# EAGLE design Arduino-M0-V1 (EAGLE 6.4)

## Sheet 1 of 2
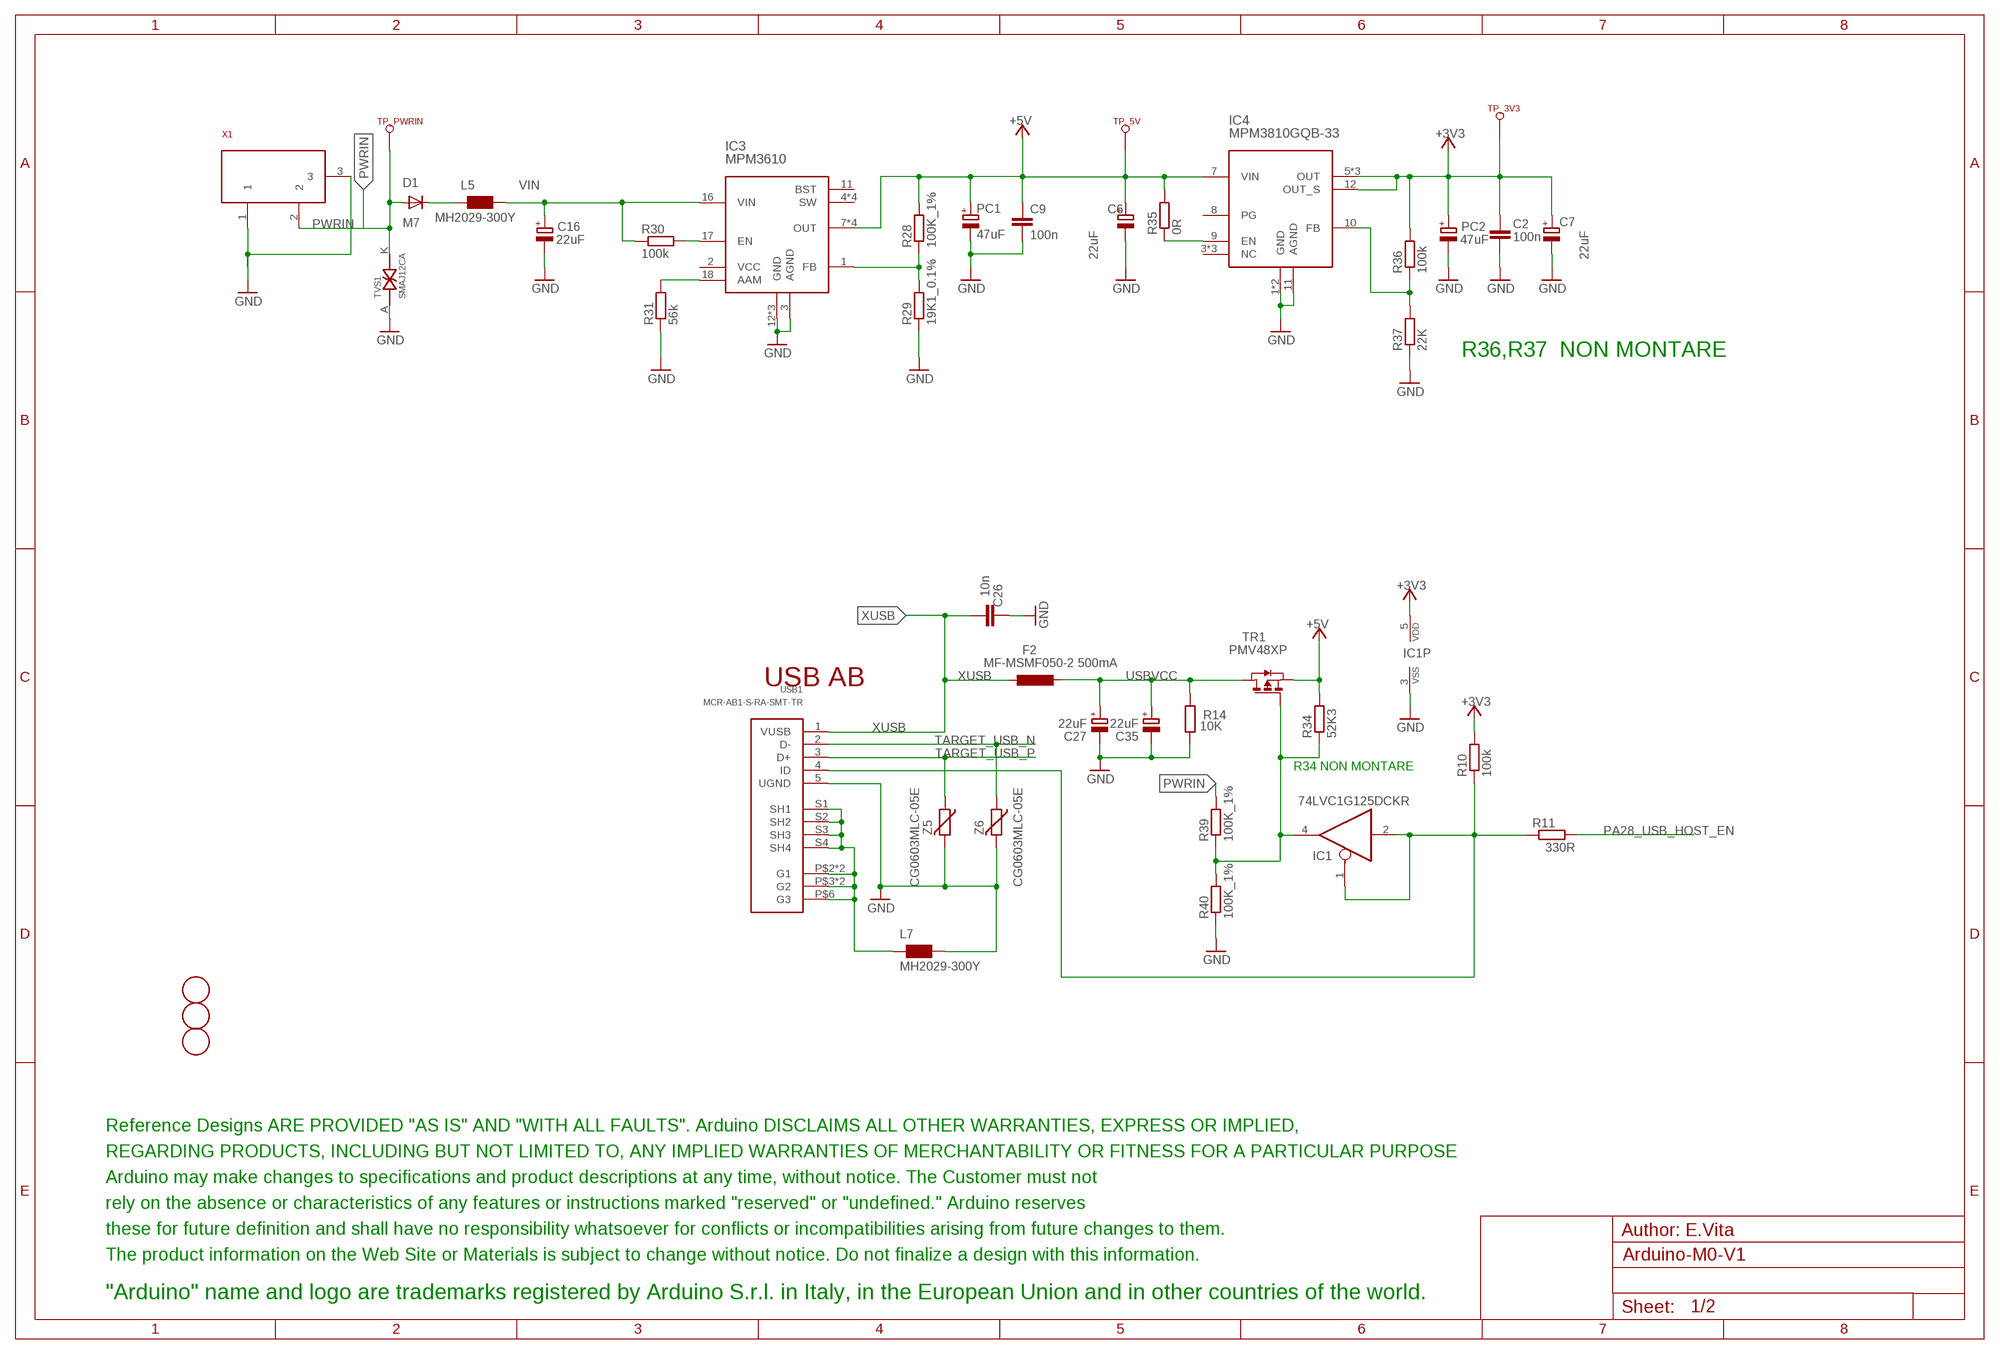
[diagram p0: schematic, sheet 1]

### Parts
C2  100n  0015_100NF_0603  [C0603-ROUND]
C6  22uF  0167_  [SMC_B]
C7  22uF  0167_  [SMC_B]
C9  100n  0015_100NF_0603  [C0603-ROUND]
C16  22uF  0167_  [SMC_B]
C26  10n  0142_10NF_0603  [C0603-ROUND]
C27  22uF  0167_  [SMC_B]
C35  22uF  0167_  [SMC_B]
D1  M7  0020_M7  [SMB]
F2  MF-MSMF050-2 500mA  0002_MF-MSMF050-2  [L1812]
FD1  FIDUCIALMOUNT  [FIDUCIA-MOUNT]
FD2  FIDUCIALMOUNT  [FIDUCIA-MOUNT]
FD3  FIDUCIALMOUNT  [FIDUCIA-MOUNT]
IC1  74LVC1G125DCKR  0040_SN74LVC1G125DCKR  [SC70-5]
IC3  MPM3610  2093_MPM3610GQV-P  [QFN-20]
IC4  MPM3810GQB-33  2068_MPM3810GQB-33  [QFN-12]
L5  MH2029-300Y  0001_BLM21PG300SN1D_/_MH2029-300Y  [0805]
L7  MH2029-300Y  0001_BLM21PG300SN1D_/_MH2029-300Y  [0805]
PC1  47uF  0113_47UF  [PANASONIC_D]
PC2  47uF  0113_47UF  [PANASONIC_D]
R10  100k  0026_100K_0603  [R0603-ROUND]
R11  330R  0049_330R_0603  [R0603-ROUND]
R14  10K  0028_CR0603JW103L  [R0603-ROUND]
R28  100K_1%  2022_CR0603FW104L  [R0603-ROUND]
R29  19K1_0.1%  2339_  [R0603-ROUND]
R30  100k  0026_100K_0603  [R0603-ROUND]
R31  56k  0411_56K_0603  [R0603-ROUND]
R34  52K3  0180_52K3_0603  [R0603-ROUND]
R35  0R  0233_0R_0603  [R0603-ROUND]
R36  100k  0026_100K_0603  [R0603-ROUND]
R37  22K  0194_  [R0603-ROUND]
R39  100K_1%  2022_CR0603FW104L  [R0603-ROUND]
R40  100K_1%  2022_CR0603FW104L  [R0603-ROUND]
TP_3V3  TP_SP  [TP-SP]
TP_5V  TP_SP  [TP-SP]
TP_PWRIN  TP_SP  [TP-SP]
TR1  PMV48XP  0297_PMV48XP  [SOT-23]
TVS1  SMAJ12CA  2194_SMAJ12CA  [SMA-TVS]
U$1  DISCLAIMER-SMALL  [DISCLAIMER]
USB1  MCR-AB1-S-RA-SMT-TR  0631_MCR-AB1-S-RA-SMT-TRHOLES  [MCR-AB1-S-RA-SMT-SINGLHOLES]
X1  0018_19746-POWER-SUPPLY  [POWERSUPPLY_DC-21MM]
Z5  CG0603MLC-05E  0010_BRNCG0603MLC-05E  [CT/CN0603]
Z6  CG0603MLC-05E  0010_BRNCG0603MLC-05E  [CT/CN0603]

### Nets
+3V3: C2.2 C7.+ IC1.5(VDD) IC4.5(OUT) IC4.6(OUT) IC4.12(OUT_S) IC4.14(OUT) PC2.+ R10.2 R36.2 TP_3V3.X(TESTP) ; also sheet 2
+5V [usbvcc]: C6.+ C9.1 IC3.7(OUT) IC3.8(OUT) IC3.9(OUT) IC3.20(OUT) IC4.7(VIN) PC1.+ R28.2 R34.2 R35.2 TP_5V.X(TESTP) TR1.2(S) ; also sheet 2
GND [gnd]: C2.1 C6.- C7.- C9.2 C16.- C26.2 C27.- C35.- IC1.3(VSS) IC3.3(AGND) IC3.12(GND) IC3.13(GND) IC3.14(GND) IC4.1(GND) IC4.2(GND) IC4.11(AGND) L7.2 PC1.- PC2.- R14.1 R29.1 R31.1 R37.1 R40.1 TVS1.A(AK) USB1.5(UGND) X1.1 X1.3 Z5.2 Z6.2 ; also sheet 2
N$6: IC1.4(O) R34.1 R39.1 R40.2 TR1.3(G)
N$7: IC1.1(OE) IC1.2(I) R10.1 R11.1 USB1.4(ID)
N$8: D1.C L5.1
N$9: IC4.9(EN) R35.1
N$11: IC4.10(FB) R36.1 R37.2
N$15 [gnd]: L7.1 USB1.P$2(G1) USB1.P$3(G2) USB1.P$6(G3) USB1.P$8(G1) USB1.P$10(G2) USB1.S1(SH1) USB1.S2(SH2) USB1.S3(SH3) USB1.S4(SH4)
N$26: IC3.1(FB) R28.1 R29.2
N$28: IC3.17(EN) R30.2
N$29: IC3.18(AAM) R31.2
PA28_USB_HOST_EN: R11.2 ; also sheet 2
PWRIN [USB]: D1.A R39.2 TP_PWRIN.X(TESTP) TVS1.K(KA) X1.2 ; also sheet 2
TARGET_USB_N [USBpair]: USB1.2(D-) Z6.1 ; also sheet 2
TARGET_USB_P [USBpair]: USB1.3(D+) Z5.1 ; also sheet 2
USBVCC [usbvcc]: C27.+ C35.+ F2.1 R14.2 TR1.1(D)
VIN [gnd]: C16.+ IC3.16(VIN) L5.2 R30.1
XUSB [usbvcc]: C26.1 F2.2 USB1.1(VUSB)
Unconnected: IC3.2(VCC) IC3.4(SW) IC3.5(SW) IC3.6(SW) IC3.11(BST) IC3.19(SW) IC4.3(NC) IC4.4(NC) IC4.8(PG) IC4.13(NC)

### Notes on the sheet
- R36,R37  NON MONTARE
- USB AB
- R34 NON MONTARE
- Author: E.Vita

## Sheet 2 of 2
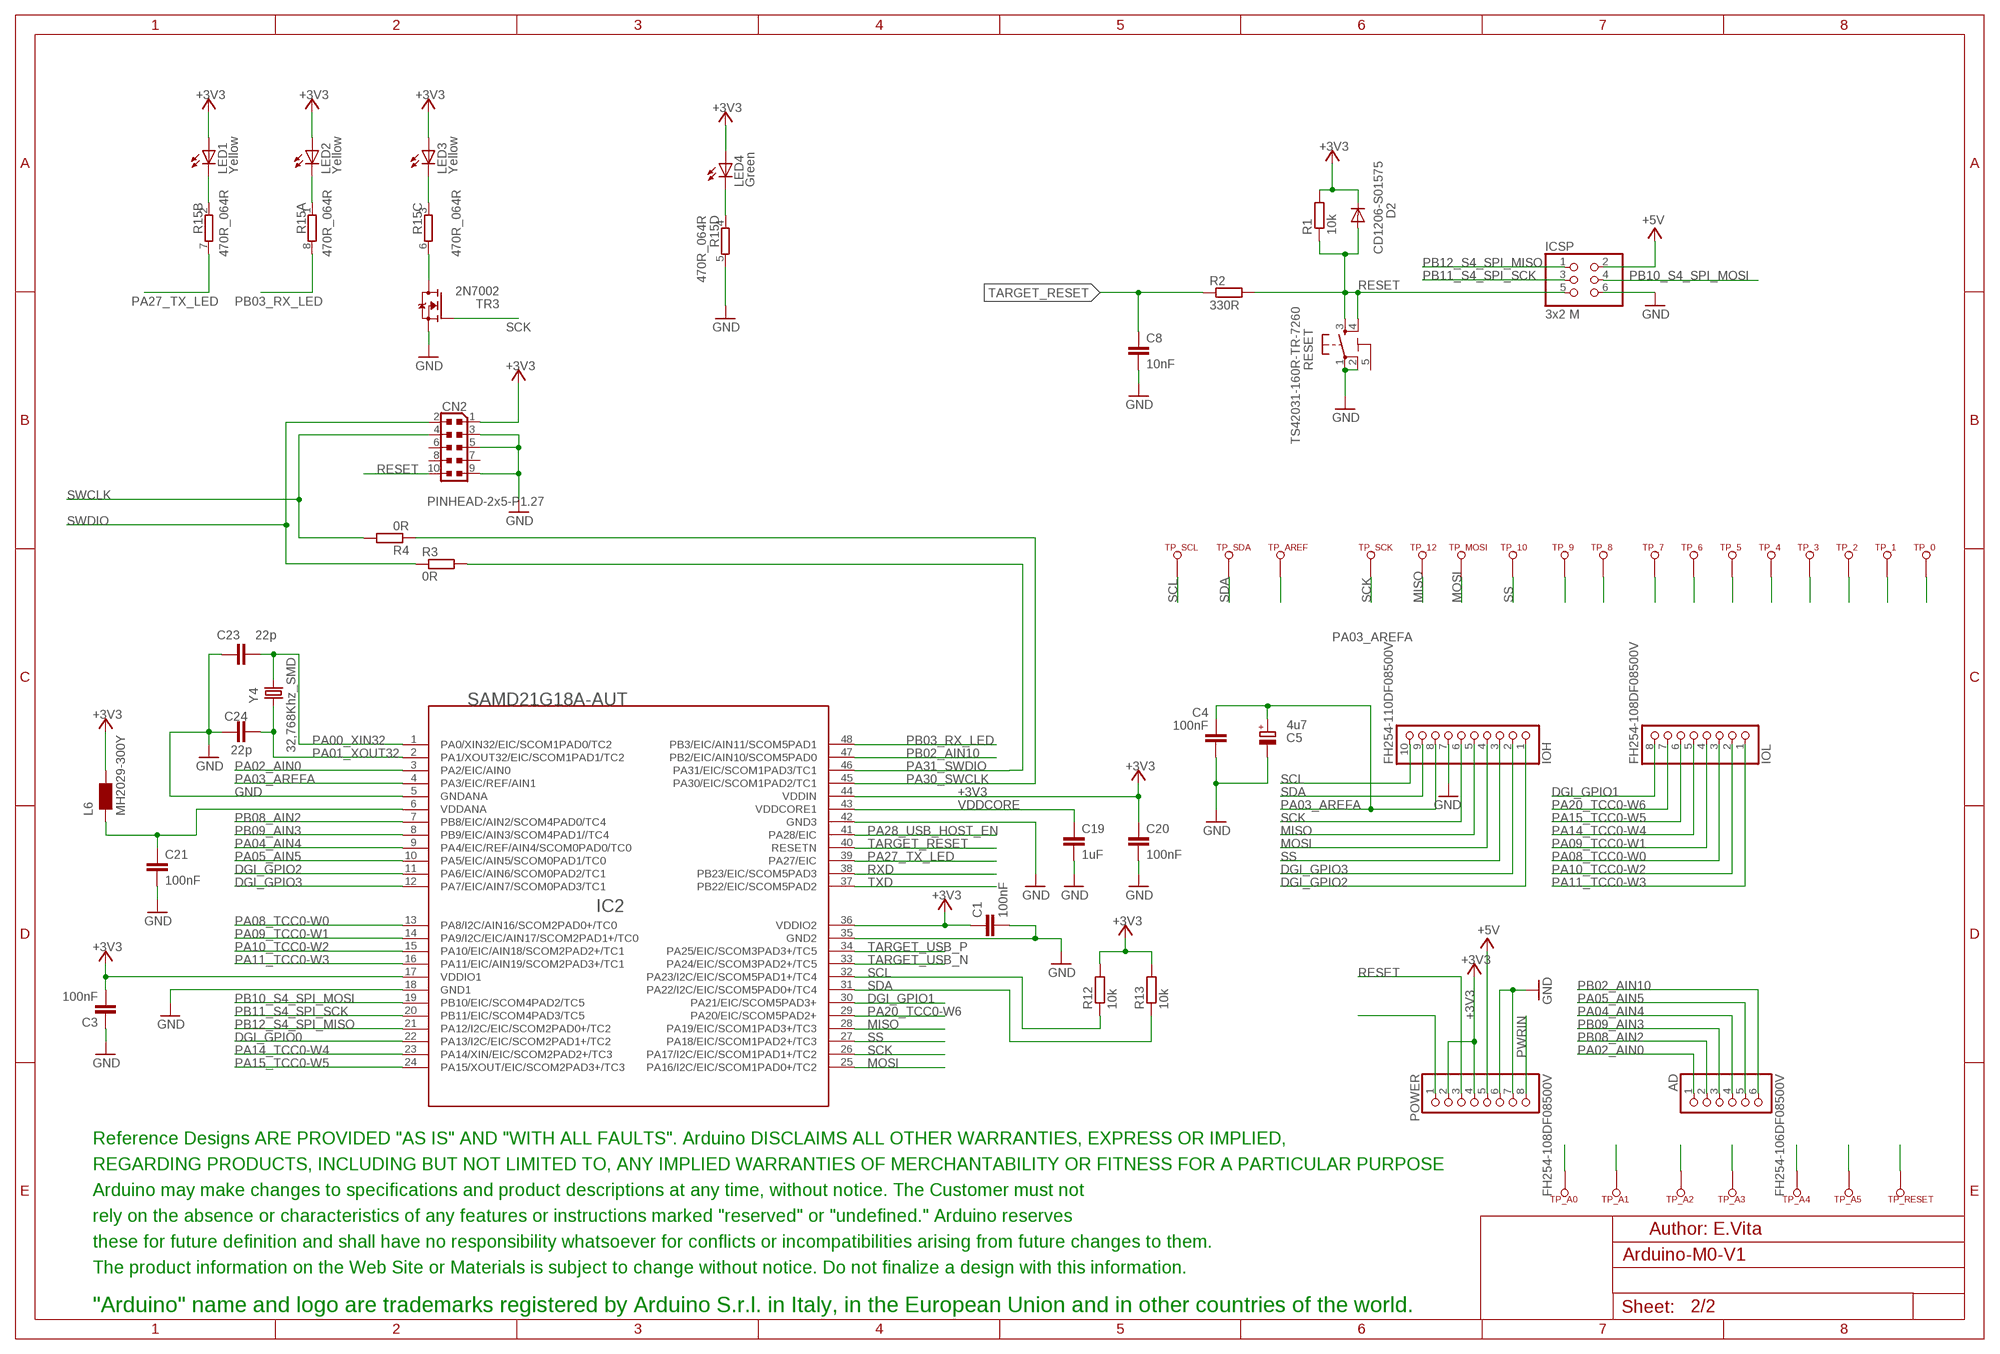
[diagram p1: schematic, sheet 2]

### Parts
AD  FH254-106DF08500V  1682_20TW-535_STD  [1X06]
C1  100nF  0015_100NF_0603  [C0603-ROUND]
C3  100nF  0015_100NF_0603  [C0603-ROUND]
C4  100nF  0015_100NF_0603  [C0603-ROUND]
C5  4u7  0474_TAJA475M016RNJ  [SMC_A]
C8  10nF  0142_10NF_0603  [C0603-ROUND]
C19  1uF  0006_1UF_0603/GRM188R61E105KA12D  [C0603-ROUND]
C20  100nF  0015_100NF_0603  [C0603-ROUND]
C21  100nF  0015_100NF_0603  [C0603-ROUND]
C23  22p  0014_22PF_0603  [C0603-ROUND]
C24  22p  0014_22PF_0603  [C0603-ROUND]
CN2  PINHEAD-2x5-P1.27  0171_PH127-205DF055G00AROUND-PADS  [PINHEAD_2X05_127]
D2  CD1206-S01575  0012_CD1206-S01575  [MINIMELF]
IC2  SAMD21G18A-AUT  1792_SAMD21G18A-AUT  [TQFP48-7X7]
ICSP  3x2 M  0114_PH254-203DF118A00V  [2X03]
IOH  FH254-110DF08500V  1684_20TW-537  [1X10]
IOL  FH254-108DF08500V  1683_20TW-536  [1X08]
L6  MH2029-300Y  0001_BLM21PG300SN1D_/_MH2029-300Y  [0805]
LED1  Yellow  0044_KPT-2012YC  [CHIPLED_0805]
LED2  Yellow  0044_KPT-2012YC  [CHIPLED_0805]
LED3  Yellow  0044_KPT-2012YC  [CHIPLED_0805]
LED4  Green  0043_KPT-2012SGC  [CHIPLED_0805]
POWER  FH254-108DF08500V  1683_20TW-536  [1X08]
R1  10k  0028_CR0603JW103L  [R0603-ROUND]
R2  330R  0049_330R_0603  [R0603-ROUND]
R3  0R  0233_0R_0603  [R0603-ROUND]
R4  0R  0233_0R_0603  [R0603-ROUND]
R12  10k  0028_CR0603JW103L  [R0603-ROUND]
R13  10k  0028_CR0603JW103L  [R0603-ROUND]
R15  470R_064R  0540_CAY16-471J4LF  [CAY16]
RESET  TS42031-160R-TR-7260  0946_TS42031-160W-TR-7260  [TS42]
TP_0  TP_SP  [TP-SP]
TP_1  TP_SP  [TP-SP]
TP_2  TP_SP  [TP-SP]
TP_3  TP_SP  [TP-SP]
TP_4  TP_SP  [TP-SP]
TP_5  TP_SP  [TP-SP]
TP_6  TP_SP  [TP-SP]
TP_7  TP_SP  [TP-SP]
TP_8  TP_SP  [TP-SP]
TP_9  TP_SP  [TP-SP]
TP_10  TP_SP  [TP-SP]
TP_12  TP_SP  [TP-SP]
TP_A0  TP_SP  [TP-SP]
TP_A1  TP_SP  [TP-SP]
TP_A2  TP_SP  [TP-SP]
TP_A3  TP_SP  [TP-SP]
TP_A4  TP_SP  [TP-SP]
TP_A5  TP_SP  [TP-SP]
TP_AREF  TP_SP  [TP-SP]
TP_MOSI  TP_SP  [TP-SP]
TP_RESET  TP_SP  [TP-SP]
TP_SCK  TP_SP  [TP-SP]
TP_SCL  TP_SP  [TP-SP]
TP_SDA  TP_SP  [TP-SP]
TR3  2N7002  1612_2N7002LT1G  [SOT-23]
U$2  DISCLAIMER-SMALL  [DISCLAIMER]
Y4  32,768Khz_SMD  0213_ABS07-32.768KHZ-T  [RESONATOR_EPSON_FC_145]

### Nets
+3V3: C1.1 C3.2 C20.1 CN2.1 D2.C IC2.17(VDDIO1) IC2.36(VDDIO2) IC2.44(VDDIN) L6.2 LED1.A LED2.A LED3.A LED4.A POWER.2 POWER.4 R1.2 R12.2 R13.2 ; also sheet 1
+5V [usbvcc]: ICSP.2 POWER.5 ; also sheet 1
DGI_GPIO0: IC2.22(PA13/I2C/EIC/SCOM2PAD1+/TC2)
DGI_GPIO1: IC2.30(PA21/EIC/SCOM5PAD3+) IOL.8 TP_7.X(TESTP)
DGI_GPIO2: IC2.11(PA6/EIC/AIN6/SCOM0PAD2/TC1) IOH.1 TP_8.X(TESTP)
DGI_GPIO3: IC2.12(PA7/EIC/AIN7/SCOM0PAD3/TC1) IOH.2 TP_9.X(TESTP)
GND [gnd]: C1.2 C3.1 C4.2 C5.- C8.2 C19.2 C20.2 C21.2 C23.1 C24.1 CN2.3 CN2.5 CN2.9 IC2.5(GNDANA) IC2.18(GND1) IC2.35(GND2) IC2.42(GND3) ICSP.6 IOH.7 POWER.6 POWER.7 R15.5 RESET.1 RESET.2 TR3.2(S) ; also sheet 1
MISO: IC2.28(PA19/EIC/SCOM1PAD3+/TC3) IOH.5 TP_12.X(TESTP)
MOSI: IC2.25(PA16/I2C/EIC/SCOM1PAD0+/TC2) IOH.4 TP_MOSI.X(TESTP)
N$1: LED1.C R15.2
N$2: LED2.C R15.1
N$3: LED3.C R15.3
N$4: LED4.C R15.4
N$5: R15.6 TR3.1(D)
N$10: C21.1 IC2.6(VDDANA) L6.1
N$56: POWER.1
PA00_XIN32: C23.2 IC2.1(PA0/XIN32/EIC/SCOM1PAD0/TC2) Y4.P$2
PA01_XOUT32: C24.2 IC2.2(PA1/XOUT32/EIC/SCOM1PAD1/TC2) Y4.P$1
PA02_AIN0: AD.1 IC2.3(PA2/EIC/AIN0) TP_A0.X(TESTP)
PA03_AREFA: C4.1 C5.+ IC2.4(PA3/EIC/REF/AIN1) IOH.8 TP_AREF.X(TESTP)
PA04_AIN4: AD.4 IC2.9(PA4/EIC/REF/AIN4/SCOM0PAD0/TC0) TP_A3.X(TESTP)
PA05_AIN5: AD.5 IC2.10(PA5/EIC/AIN5/SCOM0PAD1/TC0) TP_A4.X(TESTP)
PA08_TCC0-W0: IC2.13(PA8/I2C/AIN16/SCOM2PAD0+/TC0) IOL.3 TP_2.X(TESTP)
PA09_TCC0-W1: IC2.14(PA9/I2C/EIC/AIN17/SCOM2PAD1+/TC0) IOL.4 TP_3.X(TESTP)
PA10_TCC0-W2: IC2.15(PA10/EIC/AIN18/SCOM2PAD2+/TC1) IOL.2 TP_1.X(TESTP)
PA11_TCC0-W3: IC2.16(PA11/EIC/AIN19/SCOM2PAD3+/TC1) IOL.1 TP_0.X(TESTP)
PA14_TCC0-W4: IC2.23(PA14/XIN/EIC/SCOM2PAD2+/TC3) IOL.5 TP_4.X(TESTP)
PA15_TCC0-W5: IC2.24(PA15/XOUT/EIC/SCOM2PAD3+/TC3) IOL.6 TP_5.X(TESTP)
PA20_TCC0-W6: IC2.29(PA20/EIC/SCOM5PAD2+) IOL.7 TP_6.X(TESTP)
PA27_TX_LED: IC2.39(PA27/EIC) R15.7
PA28_USB_HOST_EN: IC2.41(PA28/EIC) ; also sheet 1
PA30_SWCLK: IC2.45(PA30/EIC/SCOM1PAD2/TC1) R4.1
PA31_SWDIO: IC2.46(PA31/EIC/SCOM1PAD3/TC1) R3.2
PB02_AIN10: AD.6 IC2.47(PB2/EIC/AIN10/SCOM5PAD0) TP_A5.X(TESTP)
PB03_RX_LED: IC2.48(PB3/EIC/AIN11/SCOM5PAD1) R15.8
PB08_AIN2: AD.2 IC2.7(PB8/EIC/AIN2/SCOM4PAD0/TC4) TP_A1.X(TESTP)
PB09_AIN3: AD.3 IC2.8(PB9/EIC/AIN3/SCOM4PAD1//TC4) TP_A2.X(TESTP)
PB10_S4_SPI_MOSI: IC2.19(PB10/EIC/SCOM4PAD2/TC5) ICSP.4
PB11_S4_SPI_SCK: IC2.20(PB11/EIC/SCOM4PAD3/TC5) ICSP.3
PB12_S4_SPI_MISO: IC2.21(PA12/I2C/EIC/SCOM2PAD0+/TC2) ICSP.1
PWRIN [USB]: POWER.8 ; also sheet 1
RESET: CN2.10 D2.A ICSP.5 POWER.3 R1.1 R2.2 RESET.3 RESET.4 TP_RESET.X(TESTP)
RXD: IC2.38(PB23/EIC/SCOM5PAD3)
SCK: IC2.26(PA17/I2C/EIC/SCOM1PAD1+/TC2) IOH.6 TP_SCK.X(TESTP) TR3.3(G)
SCL: IC2.32(PA23/I2C/EIC/SCOM5PAD1+/TC4) IOH.10 R12.1 TP_SCL.X(TESTP)
SDA: IC2.31(PA22/I2C/EIC/SCOM5PAD0+/TC4) IOH.9 R13.1 TP_SDA.X(TESTP)
SS: IC2.27(PA18/EIC/SCOM1PAD2+/TC3) IOH.3 TP_10.X(TESTP)
SWCLK: CN2.4 R4.2
SWDIO: CN2.2 R3.1
TARGET_RESET: C8.1 IC2.40(RESETN) R2.1
TARGET_USB_N [USBpair]: IC2.33(PA24/EIC/SCOM3PAD2+/TC5) ; also sheet 1
TARGET_USB_P [USBpair]: IC2.34(PA25/EIC/SCOM3PAD3+/TC5) ; also sheet 1
TXD: IC2.37(PB22/EIC/SCOM5PAD2)
VDDCORE: C19.1 IC2.43(VDDCORE1)
Unconnected: CN2.6 CN2.7 CN2.8

### Notes on the sheet
- Author: E.Vita

## Power pins joined to a net without a drawn wire
5-GND: RESET.5(5-GND)

## Library data of the parts
AD = Connettori:1682_20TW-535: Female Gray Connector strip for Arduino 3V3 bases - 6x1 F V h 8,5 p2,54; MONTHLY_USAGE: 86722.85; PART_NUMBER: 20TW-535; PRICE: _0.03; SUPPLIER: CBC_elettronica__s.r.l.; TYPE: Connettori
C1 C3 C4 C20 C21 = Condensatori:0015_100NF_0603: 100nF 0603 50V; CASE: 0603; MONTHLY_USAGE: _____; PART_NUMBER: cl10b104kbnc; PRICE: _____; SUPPLIER: _____; TYPE: Condensatori
C2 C9 = Condensatori:0015_100NF_0603: 100nF 0603 50V; CASE: 0603; MONTHLY_USAGE: _____; PART_NUMBER: cl10b104kbnc; PRICE: _____; SUPPLIER: _____; TYPE: Condensatori; VALUE: 100nF
C5 = Condensatori:0474_TAJA475M016RNJ: 4u7 tantalio Case A - testa gialla -Tantalio; CASE: CaseA_(1206); MONTHLY_USAGE: _____; PART_NUMBER: TAJA475M016RNJ; PRICE: _____; SUPPLIER: _____; TYPE: Condensatori
C6 C7 C16 C27 C35 = Condensatori:0167_: 22uF 25V; MONTHLY_USAGE: _____; PRICE: _____; SUPPLIER: _____; TYPE: Condensatori
C8 = Condensatori:0142_10NF_0603: 10nF 0603; CASE: 0603; MONTHLY_USAGE: _____; PART_NUMBER: 10nF_0603; PRICE: _____; SUPPLIER: _____; TYPE: Condensatori
C19 = Condensatori:0006_1UF_0603/GRM188R61E105KA12D: 1uF 0603; CASE: 0603; MONTHLY_USAGE: _____; PART_NUMBER: 1uF_0603/GRM188R61E105KA12D; PRICE: _____; SUPPLIER: _____; TYPE: Condensatori
C23 C24 = Condensatori:0014_22PF_0603: 22pF 0603; CASE: 0603; MONTHLY_USAGE: _____; PART_NUMBER: 22pF_0603; PRICE: _____; SUPPLIER: _____; TYPE: Condensatori
C26 = Condensatori:0142_10NF_0603: 10nF 0603; CASE: 0603; MONTHLY_USAGE: _____; PART_NUMBER: 10nF_0603; PRICE: _____; SUPPLIER: _____; TYPE: Condensatori; VALUE: 10nF
CN2 = Connettori:0171_PH127-205DF055G00A: 2x5 PASSO 1,27
D1 = Diodi:0020_M7: 1.0A 40V SURFACE MOUNT GLASS PASSIVATED RECTIFIER M7; CASE: SMA; MONTHLY_USAGE: _____; PART_NUMBER: M7; PRICE: _____; SUPPLIER: _____; TYPE: Diodi
D2 = Diodi:0012_CD1206-S01575: small-signal high-speed Switching Diodes CD1206; CASE: 1206; MONTHLY_USAGE: _____; PART_NUMBER: CD1206-S01575; PRICE: _____; SUPPLIER: _____; TYPE: Diodi
F2 = Protezione:0002_MF-MSMF050-2: 500 mA Multifuse � Polyfuse; MONTHLY_USAGE: _____; PART_NUMBER: MF-MSMF050-2; PRICE: _____; SUPPLIER: _____; TYPE: Protezione
FD1-FD3 = SmartPrj:FIDUCIALMOUNT
IC1 = IntegratedCircuits:0040_SN74LVC1G125DCKR: Single bus buffer with 3-state output; CASE: SC70; MONTHLY_USAGE: _____; PART_NUMBER: SN74LVC1G125DCKR; PRICE: _____; SUPPLIER: _____; TYPE: Circuito_Integrato
IC2 = IntegratedCircuits:1792_SAMD21G18A-AUT: Atmel D21 32bit ARM Cortex-M0 microcontroller - 48 PIN TQFP 256KB flash memory + 32KB SRAM
IC3 = IntegratedCircuits:2093_MPM3610GQV-P: MPM3610 Step Down Regulator; CASE: QFN-20; PART_NUMBER: MPM3610GQV-P; TYPE: Circuito_Integrato
IC4 = IntegratedCircuits:2068_MPM3810GQB-33: MPM3810 6V Input, 1.2A Module Synchronous Step-Down Converter with Integrated Inductor; PART_NUMBER: MPM3810GQB-33
ICSP = Connettori:0114_PH254-203DF118A00V: 3x2 M V h 8,5 mm p2,54; MONTHLY_USAGE: _____; PART_NUMBER: PH254-203DF118A00V; PRICE: _____; SUPPLIER: _____; TYPE: Connettori; VALUE: ICSP
IOH = Connettori:1684_20TW-537: Female Gray Connector strip for Arduino 3V3 bases - 10x1 F V h 8,5 p2,54mm; MONTHLY_USAGE: _____; PART_NUMBER: 20TW-537; PRICE: _____; SUPPLIER: _____; TYPE: Connettori
IOL POWER = Connettori:1683_20TW-536: Female Gray Connector strip for Arduino 3V3 bases - 8x1 F V h 8,5 p2,54mm; MONTHLY_USAGE: _____; PART_NUMBER: 20TW-536; PRICE: _____; SUPPLIER: _____; TYPE: Connettori
L5-L7 = Protezione:0001_BLM21PG300SN1D_/_MH2029-300Y: BLM21; MONTHLY_USAGE: _____; PART_NUMBER: BLM21PG300SN1D_/_MH2029-300Y; PRICE: _____; SUPPLIER: _____; TYPE: Protezione
LED1-LED3 = Opto:0044_KPT-2012YC: LED YELLOW - SMD - 0805; MONTHLY_USAGE: _____; PART_NUMBER: KPT-2012YC; PRICE: _____; SUPPLIER: _____; TYPE: Opto
LED4 = Opto:0043_KPT-2012SGC: LED GREEN - SMD-0805; MONTHLY_USAGE: _____; PART_NUMBER: KPT-2012SGC; PRICE: _____; SUPPLIER: _____; TYPE: Opto
PC1 PC2 = Condensatori:0113_47UF: 47uF; MONTHLY_USAGE: _____; PART_NUMBER: 47uF; PRICE: _____; SUPPLIER: _____; TYPE: Condensatori
R1 R12 R13 = Resistenze:0028_CR0603JW103L: 10K 0603; CASE: 0603; MONTHLY_USAGE: _____; PART_NUMBER: CR0603JW103L; PRICE: _____; SUPPLIER: _____; TYPE: Resistenze
R2 R11 = Resistenze:0049_330R_0603: 330R 0603; CASE: 0603; MONTHLY_USAGE: _____; PART_NUMBER: 330R_0603; PRICE: _____; SUPPLIER: _____; TYPE: Resistenze
R3 R4 R35 = Resistenze:0233_0R_0603: 0R 0603; CASE: 0603; MONTHLY_USAGE: _____; PART_NUMBER: 0R_0603; PRICE: _____; SUPPLIER: _____; TYPE: Resistenze
R10 R30 R36 = Resistenze:0026_100K_0603: 100K 0603; CASE: 0603; MONTHLY_USAGE: _____; PART_NUMBER: 100K_0603; PRICE: _____; SUPPLIER: _____; TYPE: Resistenze
R14 = Resistenze:0028_CR0603JW103L: 10K 0603; CASE: 0603; MONTHLY_USAGE: _____; PART_NUMBER: CR0603JW103L; PRICE: _____; SUPPLIER: _____; TYPE: Resistenze; VALUE: 10k
R15 = Resistenze:0540_CAY16-471J4LF: 470R 064R; CASE: SMD_3,2x1,6; MONTHLY_USAGE: _____; PART_NUMBER: CAY16-471J4LF; PRICE: _____; SUPPLIER: _____; TYPE: Resistenze
R28 R39 R40 = Resistenze:2022_CR0603FW104L: 0603 Resistor 100K 1%; PART_NUMBER: CR0603FW104L
R29 = Resistenze:2339_: 19K1 0,1% 0603; CASE: 0603; MONTHLY_USAGE: _____; PRICE: _____; SUPPLIER: _____; TYPE: Resistenze; VALUE: 19K1_0,1%
R31 = Resistenze:0411_56K_0603: 56K 0603; CASE: 0603; MONTHLY_USAGE: _____; PART_NUMBER: 56K_0603; PRICE: _____; SUPPLIER: _____; TYPE: Resistenze
R34 = Resistenze:0180_52K3_0603: 52k3 0603; CASE: 0603; MONTHLY_USAGE: _____; PART_NUMBER: 52k3_0603; PRICE: _____; SUPPLIER: _____; TYPE: Resistenze; VALUE: 52k3
R37 = Resistenze:0194_: 22K 0603; CASE: 0603; MONTHLY_USAGE: _____; PRICE: _____; SUPPLIER: _____; TYPE: Resistenze; VALUE: 22K_1%
RESET = Switches:0946_TS42031-160W-TR-7260: Pushbutton 6x6 Smd - White; MONTHLY_USAGE: _____; PART_NUMBER: IT-1157AHNP-160G-G_GTR; PRICE: _____; SUPPLIER: _____; TYPE: Switches; VALUE: TS42
TP_0 TP_1-TP_3 TP_3V3 TP_4 TP_5 TP_5V TP_6-TP_10 TP_12 TP_A0 TP_A1-TP_A5 TP_AREF TP_MOSI TP_PWRIN TP_RESET TP_SCK TP_SCL TP_SDA = SmartPrj:TP_SP
TR1 = Transistors:0297_PMV48XP: 20 V, 3.5 A P-channel Trench MOSFET - PMV48XP; CASE: SOT23; MONTHLY_USAGE: _____; PART_NUMBER: PMV48XP; PRICE: _____; SUPPLIER: _____; TYPE: Transistor
TR3 = Transistors:1612_2N7002LT1G: 2N7002 60 V, 300 mA N-channel Trench MOSFET
TVS1 = Protezione:2194_SMAJ12CA: TVS Bidirectional 400W 12V, case DO-214AC (SMA); CASE: SMA-TVS; PART_NUMBER: SMAJ12CA; TYPE: Protezione
U$1 U$2 = Misc:DISCLAIMER-SMALL: DISCLAIMER
USB1 = Connettori:0631_MCR-AB1-S-RA-SMT-TR: Usb Micro F/90 Smd Tipo AB; PART_NUMBER: MCR-AB1-S-RA-SMT-TR
X1 = Connettori:0018_19746-POWER-SUPPLY: JACK; MONTHLY_USAGE: _____; PART_NUMBER: 19746; PRICE: _____; SUPPLIER: _____; TYPE: Connettori; VALUE: POWER-SUPPLY
Y4 = Cristalli:0213_ABS07-32.768KHZ-T: 32,768KHz - SMD; MONTHLY_USAGE: _____; PART_NUMBER: ABS07-32.768KHZ-T; PRICE: _____; SUPPLIER: _____; TYPE: Cristalli
Z5 Z6 = Protezione:0010_BRNCG0603MLC-05E: CG0603MLC-05E; MONTHLY_USAGE: _____; PART_NUMBER: BRNCG0603MLC-05E; PRICE: _____; SUPPLIER: _____; TYPE: Protezione; VALUE: BRNCG0603MLC-05E

## Net classes
0 default: width 0.203 mm, drill 0.406 mm, clearance 0.203 mm
1 USB: width 0.203 mm, drill 0.305 mm, clearance 0.178 mm
2 gnd: width 0.254 mm, drill 0.254 mm, clearance 0.178 mm
3 usbvcc: width 0.203 mm, drill 0.406 mm, clearance 0.178 mm
4 USBpair: width 0.254 mm, drill 0.406 mm, clearance 0.406 mm

## Board
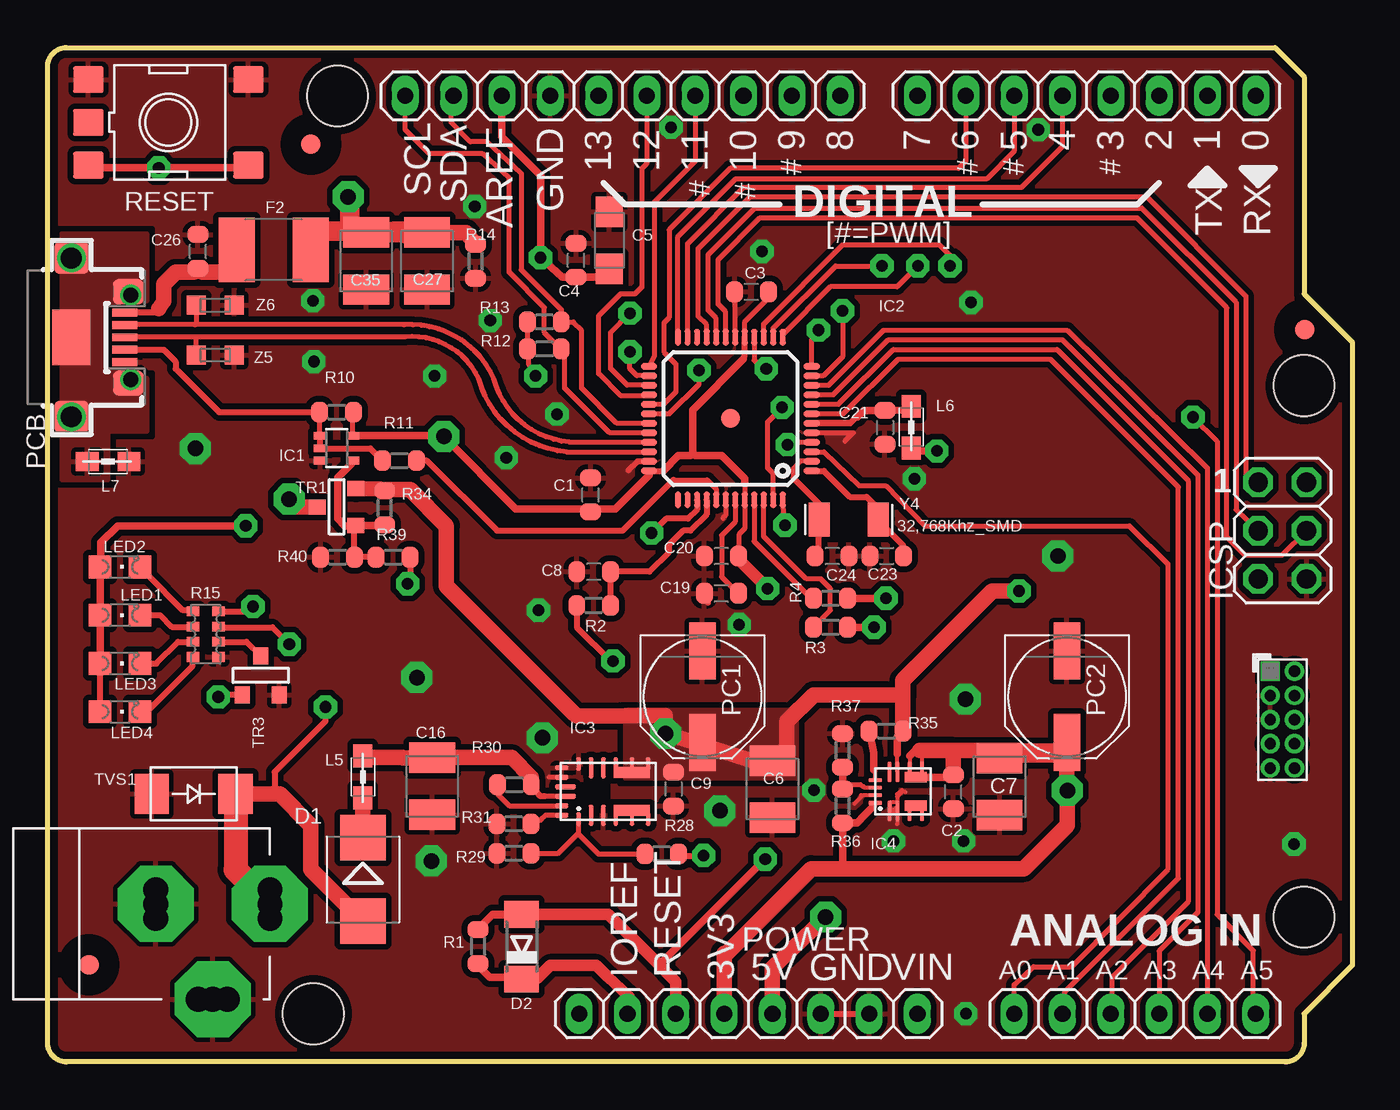
[diagram p2: board, top side]
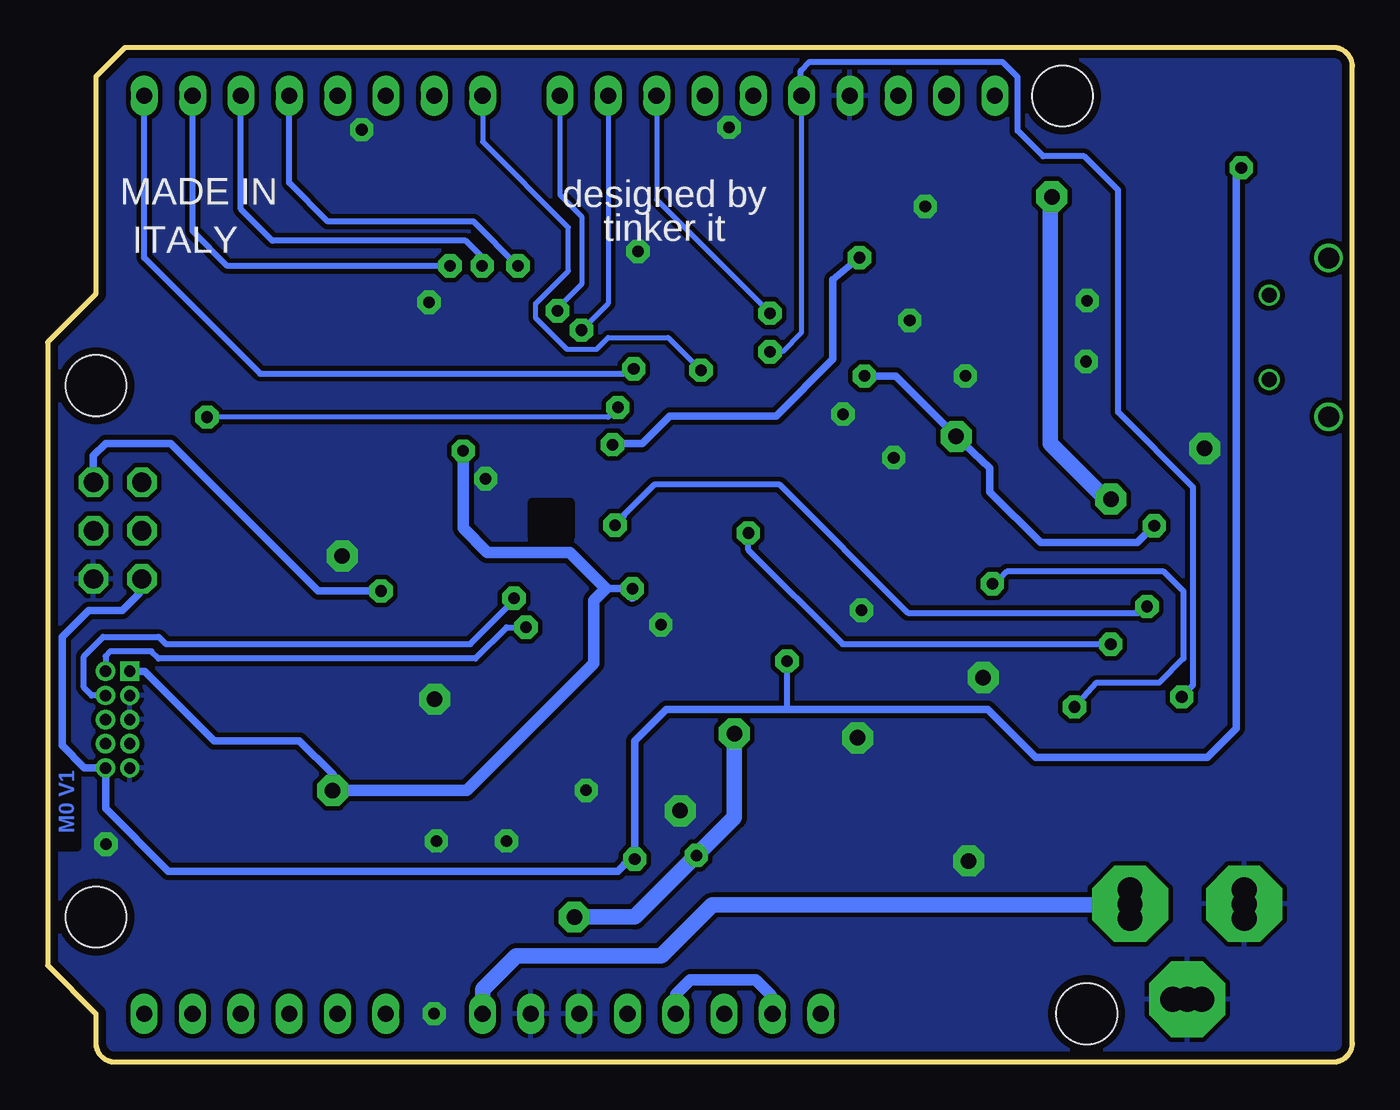
[diagram p3: board, bottom side, seen from below]

Size 68.58 x 53.34 mm. Coordinates in mm from the lower left corner, seen from the top.
Outline: 64.52,53.34 66.04,51.82 66.04,40.39 68.58,37.85 68.58,5.08 66.04,2.54 66.04,1 arc-90 65.04,0 1,0 arc-90 0,1 0,52.34 arc-90 1,53.34 64.52,53.34
Copper layers (1*2+15*16): Top 0.035mm / dielectric 0.5mm / Route2 0.035mm / dielectric 0.4mm / Ground 0.035mm / dielectric 0.5mm / Bottom 0.035mm
Design rules "ArduinoUno *": minimum track width 6mil, minimum drill 16mil, track to track 8mil, track to pad 8mil, pad to pad 4mil, via to via 8mil, smd to smd 4mil, copper to edge 16mil, drill to drill 10mil, minimum pad ring 6mil, minimum via ring 4.5mil, stop-mask expansion 1mil, vias tented up to drill 32mil, thermal gap 10mil
Holes 3.2 mm at 66.04,35.56 66.04,7.62 15.24,50.8 13.97,2.54
bRestrict: area 67.1,11.3 to 68.8,15.6
vRestrict: area 22.9,44.1 to 24.6,49.1; area 25.4,45.5 to 27.1,49.1; area 28.4,45.3 to 29.6,48.8; area 31,45.3 to 32.1,48.8; area 33.5,45.3 to 34.7,48.8; area 36.1,45.3 to 37.2,48.8; area 38.7,47.2 to 39.9,48.8; area 40.3,45.1 to 47.6,46.9; area 60.3,44.2 to 61.7,46.7; area 62.9,44.2 to 64.3,46.7; area 61.3,35.8 to 64.8,37.2; area 0.6,21.8 to 2,30.1; area 5.7,22.6 to 7.4,30.1; area 47.9,10.3 to 48.5,10.8; area 50.4,10.2 to 50.9,11; area 11.3,28.8 to 12.7,31.1; area 44.8,47.5 to 46.1,48.9; area 47.6,47.4 to 48.8,48.9; area 50.2,47.4 to 51.3,48.9; area 52.8,47.4 to 54,48.9; area 55.2,47.4 to 56.4,48.9; area 57.9,47.4 to 59.1,48.9; area 60.5,47.4 to 61.6,48.9; area 63,47.4 to 64.1,48.9; area 41.3,47.2 to 42.4,48.8; area 0.3,12.4 to 9.4,24.5

### Footprints (pad centres in the part's own frame; a part is rotated, then mirrored left to right if it is on the bottom)
1X06 = drill 0.85 pad 1.422 long: 1 -6.35,0; 2 -3.81,0; 3 -1.27,0; 4 1.27,0; 5 3.81,0; 6 6.35,0
C0603-ROUND = smd 0.898 x 1.1: 1 -0.889,0; 2 0.889,0
SMC_A = smd 1.6 x 1.4: + -1.5,0; - 1.5,0
SMC_B = smd 1.6 x 2.4: + -1.5,0; - 1.5,0
PINHEAD_2X05_127 = drill 0.6 pad 1.016 square: 1 -0.635,2.54 | drill 0.6 pad 1.016: 2 0.635,2.54; 3 -0.635,1.27; 4 0.635,1.27; 5 -0.635,0; 6 0.635,0; 7 -0.635,-1.27; 8 0.635,-1.27; 9 -0.635,-2.54; 10 0.635,-2.54
SMB = smd 2.4 x 2.4: A 2.2,0; C -2.2,0
MINIMELF = smd 1.4 x 1.8: A 1.7,0; C -1.7,0
L1812 = smd 1.9 x 3.4: 1 -1.95,0; 2 1.95,0
FIDUCIA-MOUNT = smd 1.016 x 1.016: P$1 0,0
SC70-5 = smd 0.4 x 0.7: 1 -0.65,-0.85; 2 0,-0.85; 3 0.65,-0.85; 4 0.65,0.85; 5 -0.65,0.85
TQFP48-7X7 = smd 0.85 x 0.32: 1 -4.275,2.75; 2 -4.275,2.25; 3 -4.275,1.75; 4 -4.275,1.25; 5 -4.275,0.75; 6 -4.275,0.25; 7 -4.275,-0.25; 8 -4.275,-0.75; 9 -4.275,-1.25; 10 -4.275,-1.75; 11 -4.275,-2.25; 12 -4.275,-2.75; 25 4.275,-2.75; 26 4.275,-2.25; 27 4.275,-1.75; 28 4.275,-1.25; 29 4.275,-0.75; 30 4.275,-0.25; 31 4.275,0.25; 32 4.275,0.75; 33 4.275,1.25; 34 4.275,1.75; 35 4.275,2.25; 36 4.275,2.75 | smd 0.32 x 0.85: 13 -2.75,-4.275; 14 -2.25,-4.275; 15 -1.75,-4.275; 16 -1.25,-4.275; 17 -0.75,-4.275; 18 -0.25,-4.275; 19 0.25,-4.275; 20 0.75,-4.275; 21 1.25,-4.275; 22 1.75,-4.275; 23 2.25,-4.275; 24 2.75,-4.275; 37 2.75,4.275; 38 2.25,4.275; 39 1.75,4.275; 40 1.25,4.275; 41 0.75,4.275; 42 0.25,4.275; 43 -0.25,4.275; 44 -0.75,4.275; 45 -1.25,4.275; 46 -1.75,4.275; 47 -2.25,4.275; 48 -2.75,4.275 | smd 1 x 1: P$1 0,0
QFN-20 = smd 0.7 x 0.25: 1 -1.45,1.55; 4 -1.45,-0.4; 5 -1.45,-1.25; 6 -1.45,-2.1; 7 1.45,-2.1; 8 1.45,-1.25; 9 1.45,-0.4; 12 1.45,1.55 | smd 1.1 x 0.25: 2 -1.25,0.9; 3 -1.25,0.25; 10 1.25,0.25; 11 1.25,0.9 | smd 0.25 x 0.7: 13 1.25,2.45; 14 0.75,2.45; 17 -0.75,2.45; 18 -1.25,2.45 | smd 0.25 x 1.1: 15 0.25,2.25; 16 -0.25,2.25 | smd 0.6 x 1.95: 19 -1,-1.25; 20 1,-1.25
QFN-12 = smd 1.05 x 0.2: 1 -1.025,0.7; 2 -1.025,0.3; 3 -1.025,-0.35; 4 -1.025,-1; 5 1.025,-1; 6 1.025,-0.35; 7 1.025,0.3; 8 1.025,0.7 | smd 0.2 x 0.7: 9 0.6,1.45; 10 0.2,1.45; 11 -0.2,1.45; 12 -0.6,1.45 | smd 0.55 x 1.2: 13 -0.75,-0.675; 14 0.75,-0.675
2X03 = drill 1.016 pad 1.55 octagon: 1 -2.54,-1.27; 2 -2.54,1.27; 3 0,-1.27; 4 0,1.27; 5 2.54,-1.27; 6 2.54,1.27
1X10 = drill 0.85 pad 1.422 long: 1 -11.43,0; 2 -8.89,0; 3 -6.35,0; 4 -3.81,0; 5 -1.27,0; 6 1.27,0; 7 3.81,0; 8 6.35,0; 9 8.89,0; 10 11.43,0
1X08 = drill 0.85 pad 1.422 long: 1 -8.89,0; 2 -6.35,0; 3 -3.81,0; 4 -1.27,0; 5 1.27,0; 6 3.81,0; 7 6.35,0; 8 8.89,0
0805 = smd 1.2 x 1: 1 -1.1,0; 2 1.1,0
CHIPLED_0805 = smd 1.2 x 1.2: A 0,-1.05; C 0,1.05
PANASONIC_D = smd 3 x 1.4: + 2.4,0; - -2.4,0
R0603-ROUND = smd 0.898 x 1.1: 1 -0.889,0; 2 0.889,0
CAY16 = smd 0.5 x 0.65: 1 -1.2,-0.675; 2 -0.4,-0.675; 3 0.4,-0.675; 4 1.2,-0.675; 5 1.2,0.675; 6 0.4,0.675; 7 -0.4,0.675; 8 -1.2,0.675
TS42 = smd 1.6 x 1.4: 1 -4.2,2.25; 2 4.2,2.25; 3 -4.2,-2.25; 4 4.2,-2.25; 5 -4.2,0
TP-SP = smd 0.8 x 0.8 bottom: X 0,0
SOT-23 = smd 0.787 x 0.889: 1 0.025,-1.016; 2 -0.94,1.016; 3 0.991,1.016
SMA-TVS = smd 1.8 x 2.1: A -2.2,0; K 2.2,0
MCR-AB1-S-RA-SMT-SINGLHOLES = smd 0.4 x 1.35: 1 -1.3,2.8; 2 -0.65,2.8; 3 0,2.8; 4 0.65,2.8; 5 1.3,2.8 | smd 2.9 x 2: P$2 0,0 | drill 1.1 pad 1.5: P$3 -4.175,0; P$6 4.175,0 | drill 0.8 pad 0.95: P$8 -2.225,3.125; P$10 2.225,3.125 | smd 1.3 x 1.6: S1 -2.4,3; S2 2.4,3 | smd 1.7 x 1.8: S3 -4.175,0; S4 4.175,0
POWERSUPPLY_DC-21MM = drill 1.3 pad 4 octagon: 1 -5.08,-3.353; 2 -0.076,-6.35; 3 -0.076,-0.356 | drill 1.3: 4 -5.08,-4.115; 5 -5.08,-2.591; 6 -0.838,-0.356; 7 0.686,-0.356; 8 -0.838,-6.35; 9 0.686,-6.35
RESONATOR_EPSON_FC_145 = smd 1.1 x 1.8: P$1 -1.55,0; P$2 1.55,0
CT/CN0603 = smd 1 x 1: 1 -1,0; 2 1,0

### Placement (x,y rotation side)
AD  57.15,2.54 0 top
C1  28.54,29.82 90 top
C2  47.61,14.21 90 top
C3  36.99,40.49 0 top
C4  27.78,42.16 90 top
C5  29.52,43.2 90 top
C6  38.1,14.35 270 top
C7  50.04,14.48 270 top
C8  28.7,25.78 180 top
C9  32.89,14.35 270 top
C16  20.21,14.5 270 top
C19  35.41,24.64 180 top
C20  35.41,26.6 180 top
C21  44.01,33.37 270 top
C23  44.11,26.6 0 top
C24  41.23,26.6 180 top
C26  7.91,42.62 90 top
C27  19.95,42.11 270 top
C35  16.75,42.11 270 top
CN2  64.9,18 0 top
D1  16.57,9.6 270 top
D2  24.91,6.06 90 top
F2  11.89,42.7 180 top
FD1  13.84,48.26 0 top
FD2  2.18,5.11 0 top
FD3  66.06,38.51 0 top
IC1  15.19,32.28 270 top
IC2  35.89,33.83 180 top
IC3  29.46,14.22 90 top
IC4  44.96,14.22 90 top
ICSP  64.9,27.94 270 top
IOH  30.23,50.8 180 top
IOL  54.61,50.8 180 top
L5  16.58,14.99 90 top
L6  45.4,33.38 270 top
L7  3.18,31.57 0 top
LED1  3.81,23.5 270 top
LED2  3.81,26.04 270 top
LED3  3.81,20.95 270 top
LED4  3.81,18.41 270 top
PC1  34.42,19.2 270 top
PC2  53.58,19.2 270 top
POWER  36.83,2.54 0 top
R1  22.62,6.07 270 top
R2  28.7,24 180 top
R3  41.15,22.86 180 top
R4  41.15,24.38 0 top
R10  15.19,34.17 0 top
R11  18.49,31.62 0 top
R12  26.11,37.49 180 top
R13  26.11,38.91 180 top
R14  22.5,42.1 90 top
R15  8.31,22.5 270 top
R28  32.28,10.95 0 top
R29  24.51,10.97 0 top
R30  24.53,14.58 180 top
R31  24.51,12.52 0 top
R34  17.72,29.14 90 top
R35  44.07,17.4 0 top
R36  41.78,13.46 270 top
R37  41.78,16.38 270 top
R39  18.16,26.54 0 top
R40  15.24,26.54 0 top
RESET  6.35,49.4 0 top
TP_0  63.5,50.8 0 top
TP_1  60.96,50.8 0 top
TP_2  58.42,50.8 0 top
TP_3  55.88,50.8 0 top
TP_3V3  35.56,2.54 0 top
TP_4  53.34,50.8 0 top
TP_5  50.8,50.8 0 top
TP_5V  38.1,2.54 0 top
TP_6  48.26,50.8 0 top
TP_7  45.72,50.8 0 top
TP_8  41.66,50.8 0 top
TP_9  39.12,50.8 0 top
TP_10  36.58,50.8 0 top
TP_12  31.5,50.8 0 top
TP_A0  50.8,2.54 0 top
TP_A1  53.34,2.54 0 top
TP_A2  55.88,2.54 0 top
TP_A3  58.42,2.54 0 top
TP_A4  60.96,2.54 0 top
TP_A5  63.5,2.54 0 top
TP_AREF  23.88,50.8 0 top
TP_MOSI  34.04,50.8 0 top
TP_PWRIN  13.21,8.26 0 top
TP_RESET  33.02,2.54 0 top
TP_SCK  28.96,50.8 0 top
TP_SCL  18.8,50.8 0 top
TP_SDA  21.34,50.8 0 top
TR1  15.19,29.21 270 top
TR3  11.23,20.32 180 top
TVS1  7.68,14.1 0 top
U$1  -9.02,-22.61 0 top  (outside the outline)
U$2  -9.53,-43.56 0 top  (outside the outline)
USB1  1.25,38.1 270 top
X1  5.33,8.38 90 top
Y4  42.11,28.52 0 top
Z5  8.81,37.17 0 top
Z6  8.81,39.79 0 top

### Tracks (layer width: path | path; a pad name or v marks a point on that pad's centre or on a via)
+3V3  (via drill 0.61, 0.81)
  Top 0.127: 36.63,29.57 IC2.44
  Top 0.203: 45.31,16.1 IC4.6 | IC4.5 45.96,16.37 46.1,16.38 | IC4.12 43.51,13.56
  Top 0.254: 36.33,27.02 C20.1 36.33,26.63 36.33,27.73 36.64,28.04 IC2.44 36.64,30.39 | IC2.17 36.64,38.42 36.65,38.43 36.65,38.94 37.88,40.17 C3.2 | IC1.5 16.05,34.11 R10.2 | R13.2 R12.2 25.27,37.95 25.27,36.7 v25.65,36.07 | 43.51,13.56 43.38,13.44
  Top 0.305: 37.88,40.15 C3.2 | 45.85,16.38 45.59,16.38 | C2.2 47.35,14.97 | 2.79,25.82 LED2.A | 36.58,36.96 36.64,37.15 IC2.17 | 32.35,31.08 IC2.36 31.62,31.07 31.62,30.86 | LED4.A LED3.A
  Top 0.406: IC4.14 47.35,14.97 | LED2.A LED1.A LED3.A | 36.33,27.02 36.33,26.41 | 45.31,16.1 45.59,16.38 | v10.41,28.19 3.68,28.19 2.79,27.3 2.79,25.82 | 32.35,31.08 33.15,31.88 33.78,31.88 33.91,32 | R1.2 22.62,5.06 23.24,4.45 24.83,4.45 D2.C | 43.38,13.44 42.93,12.95 42.55,12.57 R36.2 41.78,10.41 41.91,10.29 41.78,10.16 | IC1.5 20.41,32.93 v20.83,32.89 24.61,29.08 28.64,29.08 | 36.58,36.96 33.91,34.29 33.91,32 | 36.64,30.39 36.64,30.67 35.43,31.88 34.04,31.88 33.91,32 | 28.64,29.08 C1.1 | L6.2 45.54,32.13 v46.74,32.13 | 28.64,29.08 29.84,29.08 31.62,30.86
  Top 0.61: 36.33,26.41 v37.85,24.89 | POWER.2 30.55,2.61 30.55,3.44 29.45,4.49 28.85,5.08 26.42,5.08 25.7,4.36 D2.C
  Top 0.813: 45.85,16.38 46.1,16.38 47.5,16.38 47.61,16.38 | TP_3V3.X 35.56,5.71 35.69,5.71 40.13,10.16 41.78,10.16 51.31,10.16 53.59,12.45 v53.59,14.27 53.58,14.29 PC2.+ | C2.2 47.61,16.38 | 47.61,16.38 49.54,16.38 C7.+
  Top 1.016: C7.+ 50.3,15.88 50.67,16.26 53.03,16.26 PC2.+
  Bottom 0.254: TP_3V3.X
  Bottom 0.406: v37.85,24.89 39.24,24.89 | v10.41,28.19 11.3,27.3 16.38,27.3 19.05,29.97 19.05,31.24 v20.83,32.89 24,36.07 v25.65,36.07 | CN2.1 63.47,20.54 59.82,16.89 55.35,16.89 53.58,15.11 53.58,14.29 v53.59,14.27
  Bottom 0.61: v46.74,32.13 46.74,28.07 45.47,26.8 41.15,26.8 39.24,24.89 39.88,24.26 39.88,20.95 46.56,14.27 v53.59,14.27 | TP_3V3.X 35.56,3.56 34.8,4.32 31.37,4.32 30.55,3.5 30.55,2.61 POWER.2 | v37.85,24.89 37.85,24.51
  Bottom 0.813: TP_3V3.X
+5V  (via drill 0.61, 0.81)
  Top 0.203: IC4.7 44.66,16.21
  Top 0.254: 34.57,10.69 v34.48,10.86 | IC3.9 29.86,15.35 29.97,15.24 30.7,15.24 IC3.20
  Top 0.305: R28.2 33.52,10.85 34.47,10.85 | 34.47,10.85 34.42,10.79 | 34.47,10.85 v34.48,10.86
  Top 0.406: 44.66,16.21 44.66,17.1 R35.2 | TP_5V.X
  Top 0.813: v40.89,7.62 40.77,7.49 38.1,4.95 TP_5V.X | 44.91,19.3 40.26,19.3 38.86,17.91 38.86,16.51 C6.+ | 37.71,15.61 v32.48,17.26 32.39,17.26 32.46,18.21 30.56,18.21 30.53,18.19 27.81,18.19 27.74,18.26 27.71,18.26 20.95,25.02 20.95,28.19 19.05,30.1 17.79,30.1 R34.2 17.49,30.13 TR1.2 | v51.05,24.77 49.66,24.77 44.96,20.07 44.96,19.35 44.91,19.3 | R35.2 44.96,19.26 44.91,19.3
  Bottom 0.406: ICSP.2 66.17,31.88 65.53,32.51 62.1,32.51 54.36,24.77 v51.05,24.77 | TP_5V.X
  Bottom 0.813: v32.48,17.26 32.48,12.86 v34.48,10.86 37.72,7.62 v40.89,7.62
  pour Top (no thermals): 30.35,14.94 39.37,14.94 39.37,18.49 30.35,18.49
DGI_GPIO1  (via drill 0.61)
  Top 0.254: IC2.30 32.69,34.08 34.24,35.64 v34.24,36.37
  Bottom 0.254: TP_7.X 45.72,48.39 41.21,43.88 41.21,41.59 42.93,39.88 42.93,39.12 41.27,37.47 39.75,37.47 39.12,38.1 35.97,38.1 v34.24,36.37
DGI_GPIO2  (via drill 0.61)
  Top 0.254: IC2.11 40.18,36.07 40.77,36.07 41.78,37.08 v41.78,39.5
  Bottom 0.254: TP_8.X 41.66,45.59 40.51,44.45 40.51,40.89 41.78,39.62 v41.78,39.5 41.53,39.5
DGI_GPIO3  (via drill 0.61)
  Top 0.254: IC2.12 40.16,38.01 v40.51,38.48
  Bottom 0.254: TP_9.X 39.12,39.88 v40.51,38.48
GND  (via drill 0.61, 0.81)
  Top 0.203: 42.74,14.02 IC4.11 42.85,14.02 42.42,13.59 | 44.64,13.02 IC4.1 44.57,13.33 44.58,13.34 44.6,13.31 44.65,13.31 44.65,12.5 | 45.09,14.2 44.78,14.2 44.65,14.07 44.65,13.95 | 44.65,13.95 44.65,13.64 | 44.65,13.64 IC4.2 | 44.65,13.64 44.27,13.64 44.27,13.36 | 44.91,14.3 44.88,14.28 44.88,14.17 44.65,13.95
  Top 0.254: IC2.18 36.14,40.35 | IC2.42 35.64,28.74 35.5,28.6 | IC2.5 42.35,33.08 41.91,32.64 | IC3.14 26.37,14.99 26.8,14.99
  Top 0.305: POWER.6 POWER.7 | 34.46,24.4 34.71,24.16 | 36.14,40.35 36.15,40.1 | IC2.35 31,31.58 30.53,31.11
  other vias: 52.07,49.02 32.77,49.15 48.26,2.54 65.51,11.46 37.55,42.63 45.56,30.67 48.53,39.94 19.41,20.22 25.81,23.75 36.35,22.99 22.45,44.98 13.94,40.03 14,36.83 23.27,38.99 7.77,32.26 24.1,31.78 20.35,36.07 26.77,34.06 35.33,13.21 44.46,11.62 48.15,11.62 40.27,14.29 26.01,17.04 20.17,10.57 48.23,19.08 53.1,26.61
  pour Bottom (isolate 0.254, rank 2): -9.18,55.88 71.12,55.88 71.12,-1.27 -9.51,-1.27
  pour Top (isolate 0.305, rank 2): -5.08,54.46 70.16,55.24 69.89,-2.54 -5.08,-2.54
MISO
  Top 0.254: IC2.28 31.58,35.05 30.1,35.05 28.96,36.2 28.96,39.24 30.1,40.39 30.86,40.39 31.24,40.77 31.24,46.99 31.5,47.24 TP_12.X
  Bottom 0.254: TP_12.X 31.48,50.81
  Bottom 0.305: 31.48,50.81 31.46,50.79
MOSI
  Top 0.254: TP_MOSI.X 34.04,47.37 31.88,45.21 31.88,37.08 IC2.25
N$1
  Top 0.305: LED1.C 5.92,23.5 6.53,22.89 7.63,22.89 R15.2
N$2
  Top 0.305: R15.1 7.59,23.75 7.11,23.75 5.24,25.62 LED2.C
N$3
  Top 0.305: LED3.C 5.71,20.95 6.86,22.1 R15.3
N$4
  Top 0.305: LED4.C 5.33,18.54 7.62,20.83 7.62,21.28 R15.4
N$5
  Top 0.305: R15.6 10.45,22.1 TR3.1
N$6
  Top 0.305: 15.95,31.54 IC1.4 | R39.1 R40.2 16.13,28.14 TR1.3
  Top 0.406: 15.95,31.54 15.95,31.45 15.24,30.73 15.24,28.57 15.62,28.19 16.18,28.19 TR1.3 17.69,28.22 R34.1
N$7
  Top 0.254: IC1.1 14.3,32.91 R10.1 | 14.36,32.26 IC1.2
  Top 0.305: IC1.2 IC1.1 | R10.1 9.02,34.16 6.73,36.45 6.73,36.83 6.11,37.45 USB1.4 | 14.36,32.26 16.97,32.26 R11.1
N$8
  Top 0.813: 16.77,11.65 D1.C L5.1
N$9
  Top 0.203: IC4.9 43.51,15.29 43.43,15.37
  Top 0.406: 43.43,15.37 43.43,16.26 R35.1
N$10
  Top 0.305: 42.19,33.58 42.51,33.91 42.55,33.91
  Top 0.33: IC2.6 42.19,33.58
  Top 0.406: 43.37,34.26 C21.1 | C21.1 45.01,34.27 L6.1 | 42.55,33.91 42.89,34.26 C21.1
N$11
  Top 0.203: IC4.10 42.93,14.42 42.88,14.47
  Top 0.254: 42.88,14.47 42.72,14.58 42.01,14.58 R36.1
  Top 0.406: R37.2 R36.1
N$15
  pour Top: 0.76,43.56 5.21,43.56 5.21,40.01 3.68,40.01 3.71,35.97 5.21,35.97 5.21,33.15 3.17,33.15 3.17,30.61 0.76,30.61
N$26
  Top 0.254: 27.91,12.04 IC3.1 | R28.1 31.11,10.92 28.96,10.92 27.91,11.96 27.91,12.04 | R29.2 26.85,10.97 27.91,12.04
N$28
  Top 0.254: IC3.17 24.27,13.47 23.64,14.1 R30.2
N$29
  Top 0.254: R31.2 25.93,12.72 26.18,12.97 IC3.18
PA00_XIN32
  Top 0.254: IC2.1 40.29,31.08 | Y4.P$2 43.66,28.35 | 45.09,26.52 C23.2 44.99,27.14 44.96,27.18
  Top 0.305: IC2.1 40.8,31.08 42.16,29.72 43.05,29.72 43.56,29.21 44.07,28.55 Y4.P$2 43.81,28.74 43.81,28.32 44.96,27.18
PA01_XOUT32
  Top 0.254: IC2.2 39.56,31.59 39.19,31.22 39.19,30.71
  Top 0.305: 39.19,30.71 40.56,29.34 Y4.P$1 40.68,28.24 40.51,27.56 40.51,26.69 C24.2
PA02_AIN0
  Top 0.254: TP_A0.X 50.8,4.07 51.8,5 53.82,5 58.89,10.14 58.89,26.16 56.86,28.19 46.1,28.19 44.04,30.3 42.65,30.3 40.81,32.08 IC2.3 40.05,32.08
PA03_AREFA  (via drill 0.61)
  Top 0.254: IC2.4 39.02,32.58 v38.89,32.46
  Top 0.406: TP_AREF.X 23.88,48.64 25.91,46.61 v25.91,42.29 27.06,41.27 C4.1 29.09,41.27 C5.+
  Bottom 0.254: 38.94,32.51 v38.89,32.46
  Bottom 0.305: TP_AREF.X 23.92,50.76
  Bottom 0.406: 38.94,32.51 37.34,32.51 35.88,33.97 30.29,33.97 27.3,36.96 27.3,41.15 v25.91,42.29
PA04_AIN4
  Top 0.254: TP_A3.X 58.42,5.84 60.45,7.87 60.45,30.86 53.34,37.97 44.2,37.97 41.31,35.08 IC2.9
  Top 0.305: TP_A3.X 58.37,2.59
PA05_AIN5
  Top 0.254: TP_A4.X 60.96,31.23 53.58,38.48 43.94,38.48 41.04,35.58 IC2.10
PA08_TCC0-W0  (via drill 0.61 pad 0.41)
  Top 0.254: 38.64,38.37 IC2.13 38.64,38.26 41.15,40.77 44.65,40.77 v45.74,41.86
  Bottom 0.254: 58.42,50.67 TP_2.X
  Bottom 0.305: 58.3,50.69 TP_2.X 58.42,44.83 56.77,43.18 46.61,43.18 45.74,42.31 v45.74,41.86
PA09_TCC0-W1  (via drill 0.61 pad 0.41)
  Top 0.254: IC2.14 38.14,38.59 41.41,41.86 v43.86,41.86
  Bottom 0.305: v43.86,41.86 46.19,44.2 53.85,44.2 55.88,46.23 TP_3.X
PA10_TCC0-W2  (via drill 0.61 pad 0.41)
  Top 0.254: IC2.15 37.64,38.8 41.8,42.96 46.88,42.96 47.42,42.42 47.42,41.74 v47.43,41.86
  Bottom 0.305: 60.91,50.74 TP_1.X 60.96,43.69 59.13,41.86 v47.43,41.86
PA11_TCC0-W3  (via drill 0.61)
  Top 0.254: IC2.16 37.14,36.9 37.85,36.2 v37.77,36.45
  Bottom 0.305: 63.57,50.73 TP_0.X 63.5,42.29 57.4,36.2 38.15,36.2 v37.77,36.45
PA14_TCC0-W4
  Top 0.254: TP_4.X 53.34,48.13 51.18,45.97 36.58,45.97 33.64,43.04 IC2.23
PA15_TCC0-W5
  Top 0.254: IC2.24 33.12,38.12 33.12,43.41 36.14,46.43 49.35,46.43 50.8,47.88 TP_5.X
PA20_TCC0-W6
  Top 0.254: TP_6.X 48.26,47.37 47.88,46.99 35.89,46.99 32.66,43.76 32.66,39.14 32.38,38.86 32.38,37.34 33.02,36.7 33.02,35.23 32.36,34.57 31.63,34.57 IC2.29
PA27_TX_LED  (via drill 0.61)
  Top 0.305: 8.99,22.86 11.81,22.86 v12.7,21.97 | IC2.39 34.14,29.06 33.66,28.57 32.51,28.57 v31.75,27.81
  Top 0.406: 8.99,22.86 R15.7
  Bottom 0.305: v12.7,21.97 26.8,21.97 31.75,26.92 v31.75,27.81
PA28_USB_HOST_EN
  Top 0.254: 32.89,30.61 34.67,30.61 35.14,30.14 IC2.41
  Top 0.305: 19.56,31.62 R11.2 19.94,31.62 23.62,27.94 30.23,27.94 32.89,30.61
PA30_SWCLK
  Top 0.254: IC2.45 37.14,27.38 40.13,24.38 R4.1
PA31_SWDIO
  Top 0.254: R3.2 41.15,23.75 41.15,24.89 40.64,25.4 39.88,25.4 37.64,27.64 IC2.46
PB02_AIN10  (via drill 0.61)
  Top 0.254: 63.38,2.67 63.38,5.85 61.47,7.76 61.47,32.64 v60.2,33.91 | IC2.47 38.14,30.95 37.85,31.24 37.85,33.66 v38.61,34.42
  Top 0.305: TP_A5.X 63.38,2.67
  Bottom 0.254: v60.2,33.91 39.12,33.91 v38.61,34.42
PB03_RX_LED  (via drill 0.61)
  Top 0.254: v38.76,28.22 38.63,29.43 IC2.48
  Top 0.305: 11.05,24.08 v10.79,23.95 10.62,23.95 10.35,23.69 9,23.69 R15.8
  Bottom 0.305: 10.92,24.08 v10.79,23.95 | 10.74,23.95 v10.79,23.95 | v10.79,23.95 11.23,23.62 23.37,23.62 30.1,30.35 36.7,30.35 38.76,28.3 v38.76,28.22 38.28,28.7
PB08_AIN2
  Top 0.254: TP_A1.X 53.44,2.64 53.44,3.65 59.44,9.65 59.44,30.23 52.7,36.96 44.7,36.96 41.83,34.08 IC2.7
  Top 0.305: TP_A1.X 53.37,2.56
PB09_AIN3
  Top 0.254: IC2.8 41.57,34.58 44.45,37.47 53.06,37.47 59.94,30.59 59.94,8.43 55.93,4.42 55.93,2.59 TP_A2.X
PB10_S4_SPI_MOSI
  Top 0.254: ICSP.4 64.88,26.65 62.92,26.65 61.98,27.59 61.98,39.66 57.25,44.38 37.44,44.38 35.24,42.18 35.24,39.85 35.64,39.45 IC2.19
  Bottom 0.406: 66.18,27.83 ICSP.4
PB11_S4_SPI_SCK
  Top 0.254: ICSP.3 62.47,29.04 62.47,39.95 57.51,44.91 37.18,44.91 34.72,42.44 34.72,39.52 35.14,39.1 IC2.20
PB12_S4_SPI_MISO
  Top 0.254: ICSP.1 62.98,30.49 62.98,40.28 57.77,45.49 36.92,45.49 34.2,42.77 34.2,39.2 34.64,38.76 IC2.21
PWRIN  (via drill 0.61)
  Top 0.305: R39.2 19.05,25.53 v18.92,25.15 | v14.61,18.67 14.61,17.91 11.94,15.24 11.94,14.1
  Top 0.813: TVS1.K 11.94,14.1 12.19,14.1 13.84,12.45 13.84,10.13 D1.A
  Top 1.27: TVS1.K 9.88,10.11 X1.2
  Bottom 0.305: 14.86,18.29 v14.61,18.67 13.46,19.94 10.16,19.94 8.89,21.21 8.89,24.77 9.91,25.78 18.16,25.78 18.54,25.4 v18.92,25.15
  Bottom 0.813: POWER.8 45.72,3.81 43.94,5.59 36.32,5.59 33.66,8.26 TP_PWRIN.X 11.73,8.26 X1.2
RESET  (via drill 0.61)
  Top 0.305: R2.2 27.81,22.86 29.59,21.08 v29.72,21.08
  Top 0.406: RESET.3 2.02,47.02 v5.84,47.02 10.41,47.02 RESET.4 | R1.1 22.62,7 23.37,7.75 | 23.37,7.75 24.9,7.75 D2.A 23.39,7.76 23.37,7.75 | v37.72,10.67 32.34,5.29 31.96,5.29
  Top 0.61: TP_RESET.X 33.02,4.22 31.96,5.29 29.48,7.76 D2.A
  Bottom 0.305: v29.72,21.08 29.72,18.54
  Bottom 0.406: v5.84,47.02 6.1,46.76 6.1,17.53 7.62,16 16.64,16 19.18,18.54 29.72,18.54 36.07,18.54 37.72,16.89 v37.72,10.67 37.97,10.67 38.61,10.03 62.23,10.03 65.53,13.34 CN2.10 66.64,15.46 67.82,16.64 67.82,22.35 66.42,23.75 64.64,23.75 63.75,24.64 63.75,25.27 ICSP.5
SCK  (via drill 0.61)
  Top 0.254: IC2.26 | 31.6,36.07 IC2.26 | IC2.26 30.97,36.08 30.61,36.45 v30.61,37.34
  Top 0.305: TR3.3 9.14,19.31 v8.97,19.19
  Bottom 0.254: 28.96,51.27 28.99,51.31 | TP_SCK.X 28.96,38.35 29.97,37.34 v30.61,37.34
  Bottom 0.305: TP_SCK.X 28.99,50.83 28.99,51.31 28.99,52.13 28.54,52.59 18.39,52.59 17.61,51.8 17.61,48.95 17.58,48.95 16.26,47.62 14.1,47.62 12.32,45.85 12.32,34.16 8.38,30.23 8.38,19.81 9.14,19.05 8.99,19.18 v8.97,19.19
SCL
  Top 0.254: IC2.32 31.6,33.1 29.52,33.1 27.18,35.43 27.18,37.82 R12.1 27,37.47 26.11,38.35 26.11,39.67 24.26,41.53 24.26,46.48 22.86,47.75 20.07,47.75 18.8,49.02 TP_SCL.X
SDA
  Top 0.254: IC2.31 31.59,33.6 29.9,33.6 28.07,35.43 28.07,38.48 27.64,38.91 R13.1 | 21.34,50.55 TP_SDA.X 21.21,50.67 21.21,49.4 22.23,48.39 23.11,48.39 24.89,46.74 24.89,41.66 27,39.55 R13.1 | 26.92,39.11 R13.1
  Top 0.305: 21.34,51.33 TP_SDA.X
SS  (via drill 0.61)
  Top 0.254: IC2.27 30.46,35.58 29.59,36.45 29.59,38.35 v30.61,39.37
  Bottom 0.254: 36.53,50.75 TP_10.X 36.58,45.34 v30.61,39.37
SWCLK  (via drill 0.61)
  Top 0.406: v44.07,24.38 R4.2
  Bottom 0.305: CN2.4 66.26,19.27 66.67,19.68 66.67,21.34 65.66,22.35 62.74,22.35 62.36,21.97 46.35,21.97 44.07,24.26 v44.07,24.38
SWDIO  (via drill 0.61)
  Top 0.406: R3.1 v43.43,22.86
  Bottom 0.305: CN2.2 65.53,21.34 65.28,21.59 63.12,21.59 62.74,21.21 46.1,21.21 44.45,22.86 v43.43,22.86
TARGET_RESET
  Top 0.305: IC2.40 34.64,28.8 33.78,27.94 33.4,27.94 32.64,27.18 32.64,26.8 31.62,25.78 C8.1 R2.1
TARGET_USB_N
  Top 0.254: IC2.33 31.56,32.59 27.43,32.59 arc-70 23.44,35.94 arc70 18.75,38.76 7.75,38.76 | 7.75,38.76 4.45,38.76 | 4.45,38.76 4.27,38.76 4.26,38.75 USB1.2 | 4.45,38.76 4.39,38.71 | Z6.1 7.81,38.83 7.75,38.76
TARGET_USB_P
  Top 0.254: IC2.34 IC2.34 arc90 IC2.34 | IC2.34 31.54,32.08 27.28,32.08 arc-70 22.66,35.94 arc70 18.8,38.12 7.75,38.12 | 4.52,38.02 4.42,38.12 | 7.75,38.12 4.42,38.12 | 4.42,38.12 4.32,38.12 4.29,38.1 USB1.3 | Z5.1 7.81,38.06 7.75,38.12
USBVCC  (via drill 0.81)
  Top 0.813: F2.1 13.84,43.17 14.22,43.56 | R14.2 22,43.61 C27.+ | TR1.1 13.11,29.18 v12.7,29.59
  Top 1.016: 18.8,43.56 18.92,43.69 18.22,43.69 17.28,43.64 | 17.28,43.64 C35.+ | C35.+ C27.+ | 14.22,43.56 14.22,43.81 14.1,43.69 17.23,43.69 17.28,43.64 | C35.+ 16.08,43.61 15.88,43.81 15.88,45.41 v15.8,45.49
  Bottom 0.813: v12.7,29.59 13.21,29.84 15.88,32.51 15.88,45.41 v15.8,45.49
VDDCORE
  Top 0.254: IC2.43 36.14,28.39 35.43,27.69 35.43,25.51 C19.1
VIN
  Top 0.254: IC3.16 26.13,13.97
  Top 0.305: 26.13,13.97 25.9,13.97 R30.1
  Top 0.813: L5.2 16.66,16 18.67,16 C16.+ 20.85,16 24.38,16 25.42,14.96 R30.1
XUSB
  Top 0.254: 4.62,39.42 4.6,39.4 USB1.1
  Top 0.305: 4.62,39.42 5.64,39.42 6.1,40.01
  Top 0.813: 5.84,39.62 6.1,40.01 6.1,40.89 6.73,41.53 7.7,41.53 C26.1 8.05,41.73 8.13,41.53 9.65,41.53 10.03,42.04 10.03,42.61 F2.2 9.66,43.17 | 9.38,43.76 9.66,43.17 | 10.11,43.51 10.16,43.56 10.06,43.56 9.66,43.17

### Text on the board
Bottom: M0 V1
tPlace: 13 | 12 | 11 | 10 | 9 | 8 | 7 | 6 | 5 | 4 | 3 | 2 | 1 | 0
tNames: SCL | SDA | AREF | GND | # | # | # | # | # | # | DIGITAL | [#=PWM] | TX | RX | 1 | ANALOG IN | IOREF | RESET | 3V3 | 5V | GND | VIN | A0 | A1 | A2 | A3 | A4 | A5
bNames: designed by | MADE IN | tinker it | ITALY
ReferenceLC: ON
214bmp: D:/SmartProjects/Snc/a4_bn_logo2.bmp